# Altium schematic sheet Schematic.SchDoc
size A4; DrawnBy: Piotr Klimaszewski
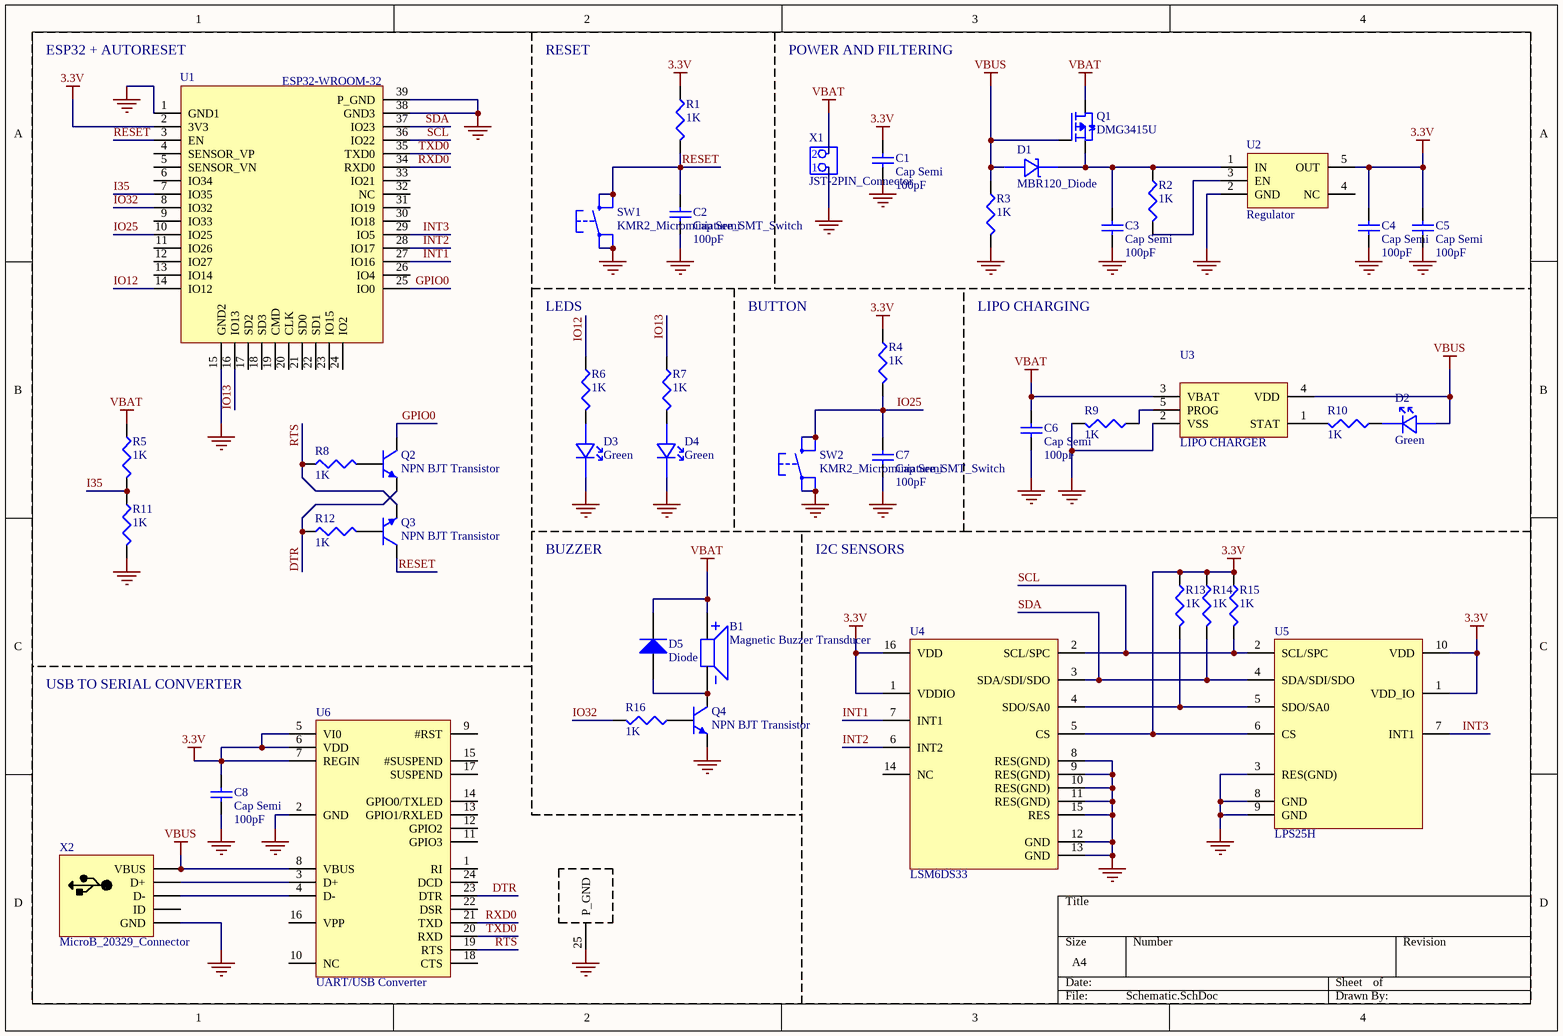
[diagram p0: Schematic.SchDoc]

## Parts
B1  Magnetic Buzzer Transducer  [CMT-0502 Buzzer]
C1  Cap Semi  value 100pF  [J1-0603]
C2  Cap Semi  value 100pF  [J1-0603]
C3  Cap Semi  value 100pF  [J1-0603]
C4  Cap Semi  value 100pF  [J1-0603]
C5  Cap Semi  value 100pF  [J1-0603]
C6  Cap Semi  value 100pF  [J1-0603]
C7  Cap Semi  value 100pF  [J1-0603]
C8  Cap Semi  value 100pF  [J1-0603]
D1  MBR120_Diode  [SML_LED]
D2  Green  [SML_LED]
D3  Green  [SML_LED]
D4  Green  [SML_LED]
D5  Diode  [SML_LED]
Q1  DMG3415U  [SOT323]
Q2  NPN BJT Transistor  [SOT323]
Q3  NPN BJT Transistor  [SOT323]
Q4  NPN BJT Transistor  [SOT323]
R1  value 1K  [J1-0603]  (hidden comment: Res3)
R2  value 1K  [J1-0603]  (hidden comment: Res3)
R3  value 1K  [J1-0603]  (hidden comment: Res3)
R4  value 1K  [J1-0603]  (hidden comment: Res3)
R5  value 1K  [J1-0603]  (hidden comment: Res3)
R6  value 1K  [J1-0603]  (hidden comment: Res3)
R7  value 1K  [J1-0603]  (hidden comment: Res3)
R8  value 1K  [J1-0603]  (hidden comment: Res3)
R9  value 1K  [J1-0603]  (hidden comment: Res3)
R10  value 1K  [J1-0603]  (hidden comment: Res3)
R11  value 1K  [J1-0603]  (hidden comment: Res3)
R12  value 1K  [J1-0603]  (hidden comment: Res3)
R13  value 1K  [J1-0603]  (hidden comment: Res3)
R14  value 1K  [J1-0603]  (hidden comment: Res3)
R15  value 1K  [J1-0603]  (hidden comment: Res3)
R16  value 1K  [J1-0603]  (hidden comment: Res3)
SW1  KMR2_Microminiature_SMT_Switch  [KMR 2 Microswitch]
SW2  KMR2_Microminiature_SMT_Switch  [KMR 2 Microswitch]
U1  ESP32-WROOM-32  [ESP_WROOM_32]
U2  Regulator  [SOT25]
U3  LIPO CHARGER  [SOT-23]
U4  LSM6DS33  [LSM6DS33]
U5  LPS25H  [LPS25HB]
U6  UART/USB Converter  [CP2104-GM]
X1  JST-2PIN_Connector  [JST-2PIN]
X2  MicroB_20329_Connector  [Micro_B_USB_smd]

## Nets
3.3V: C1.2 C4.2 C5.2 C8.2 R1.1 R4.1 R13.2 R14.2 R15.2 U1.2(3V3) U2.5(OUT) U4.1(VDDIO) U4.5(CS) U4.16(VDD) U5.1(VDD_IO) U5.6(CS) U5.10(VDD) U6.5(VI0) U6.6(VDD) U6.7(REGIN)
GND: C1.1 C2.1 C3.1 C4.1 C5.1 C6.1 C7.1 C8.1 D3.2(K) D4.2(K) Q4.1(E) R3.2 R9.1 R11.2 SW1.3 SW1.4 SW2.3 SW2.4 U1.1(GND1) U1.15(GND2) U1.38(GND3) U1.39(P_GND) U2.2(GND) U3.2(VSS) U4.8(RES(GND)) U4.9(RES(GND)) U4.10(RES(GND)) U4.11(RES(GND)) U4.12(GND) U4.13(GND) U4.15(RES) U5.3(RES(GND)) U5.8(GND) U5.9(GND) U6.2(GND) U6.25(P_GND) X1.1 X2.5(GND)
VBAT: B1.1(+) C6.2 D5.2(K) Q1.1(D) R5.1 U3.3(VBAT) X1.2
VBUS: D1.1(A) D2.1(A) Q1.2(G) R3.1 U3.4(VDD) U6.8(VBUS) X2.1(VBUS)
DTR: Q2.1(E) R12.1 U6.23(DTR)
GPIO0: Q2.3(C) U1.25(IO0)
I35: R5.2 R11.1 U1.7(IO35)
INT1: U1.27(IO16) U4.7(INT1)
INT2: U1.28(IO17) U4.6(INT2)
INT3: U1.29(IO5) U5.7(INT1)
IO12: R6.1 U1.14(IO12)
IO13: R7.1 U1.16(IO13)
IO25: C7.2 R4.2 SW2.1 SW2.2 U1.10(IO25)
IO32: R16.2 U1.8(IO32)
RESET: C2.2 Q3.3(C) R1.2 SW1.1 SW1.2 U1.3(EN)
RTS: Q3.1(E) R8.1 U6.19(RTS)
RXD0: U1.34(RXD0) U6.21(TXD)
SCL: R15.1 U1.36(IO22) U4.2(SCL/SPC) U5.2(SCL/SPC)
SDA: R14.1 U1.37(IO23) U4.3(SDA/SDI/SDO) U5.4(SDA/SDI/SDO)
TXD0: U1.35(TXD0) U6.20(RXD)
NetB1_2: B1.2(-) D5.1(A) Q4.3(C)
NetC3_2: C3.2 D1.2(K) Q1.3(S) R2.1 U2.1(IN)
NetD2_2: D2.2(K) R10.2
NetD3_1: D3.1(A) R6.2
NetD4_1: D4.1(A) R7.2
NetQ2_2: Q2.2(B) R8.2
NetQ3_2: Q3.2(B) R12.2
NetQ4_2: Q4.2(B) R16.1
NetR2_2: R2.2 U2.3(EN)
NetR9_2: R9.2 U3.5(PROG)
NetR10_1: R10.1 U3.1(STAT)
NetR13_1: R13.1 U4.4(SDO/SA0) U5.5(SDO/SA0)
NetU6_3: U6.3(D+) X2.2(D+)
NetU6_4: U6.4(D-) X2.3(D-)

Not connected (* = marked no-connect by the designer): U1 4(SENSOR_VP) 5(SENSOR_VN) 6(IO34) 9(IO33) 11(IO26) 12(IO27) 13(IO14) 17(SD2) 18(SD3) 19(CMD) 20(CLK) 21(SD0) 22(SD1) 23(IO15) 24(IO2) 26(IO4) 30(IO18) 31(IO19) 32(NC) 33(IO21); U2 4(NC); U4 14(NC); U6 1(RI) 9(#RST) 10(NC) 11(GPIO3) 12(GPIO2) 13(GPIO1/RXLED) 14(GPIO0/TXLED) 15(#SUSPEND) 16(VPP) 17(SUSPEND) 18(CTS) 22(DSR) 24(DCD); X2 4(ID)

## Notes on the sheet
- (near U1) ESP32 + AUTORESET
- RESET
- POWER AND FILTERING
- LEDS
- BUTTON
- LIPO CHARGING
- BUZZER
- I2C SENSORS
- USB TO SERIAL CONVERTER

## Library data of the parts
B1 = CMT-0502-75-SMT-TR
C1-C8 = Cap Semi: Capacitor (Semiconductor SIM Model); Published: 8-Jun-2000; LatestRevisionDate: 29-May-2009; LatestRevisionNote: IPC-7351 Footprint Added.; PackageReference: C1206; Publisher: Altium Limited; PackageDescription: Chip Capacitor
D2-D4 = SML-LX0603GW-TR_LED_Diode
D5 = Diode: Default Diode; Published: 8-Jun-2000; LatestRevisionDate: 17-Jul-2002; LatestRevisionNote: Re-released for DXP Platform.; PackageVersion: Sep-1996; PackageReference: SMC; Publisher: Altium Limited; PackageDescription: DO-214-AB/SMC; 2 C-Bend Leads; Body 7.9 x 5.9 mm, inc. leads (LxW); Code_JEDEC: DO-214-AB
Q2-Q4 = 2sd1484k
R1-R16 = Res3: Resistor; Published: 8-Jun-2000; LatestRevisionDate: 29-May-2009; LatestRevisionNote: IPC-7351 Footprint Added.; PackageReference: J1-0603; Publisher: Altium Limited; PackageDescription: Chip Resistor
U2 = AP2112-3.3
U3 = MCP7381/2
U6 = CP2104